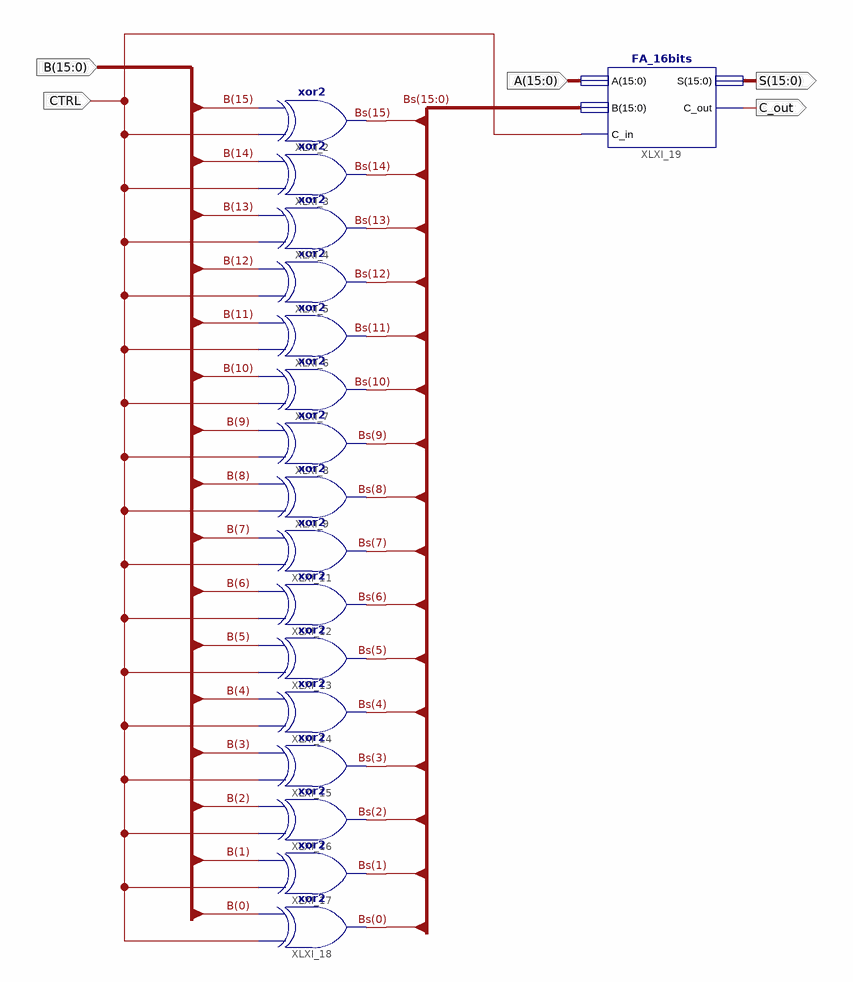
[diagram p0: schematic sheet 1]
// Xilinx ISE schematic FA_2s_16bits.sch (virtex6) as structural Verilog: 17 symbols, 5 ports
module FA_2s_16bits (
  input  [15:0] B,
  input  CTRL,
  input  [15:0] A,
  output [15:0] S,
  output C_out
);

  wire [15:0] Bs;

  xor XLXI_2 (Bs[15], CTRL, B[15]);
  xor XLXI_3 (Bs[14], CTRL, B[14]);
  xor XLXI_4 (Bs[13], CTRL, B[13]);
  xor XLXI_5 (Bs[12], CTRL, B[12]);
  xor XLXI_6 (Bs[11], CTRL, B[11]);
  xor XLXI_7 (Bs[10], CTRL, B[10]);
  xor XLXI_8 (Bs[9], CTRL, B[9]);
  xor XLXI_9 (Bs[8], CTRL, B[8]);
  xor XLXI_11 (Bs[7], CTRL, B[7]);
  xor XLXI_12 (Bs[6], CTRL, B[6]);
  xor XLXI_13 (Bs[5], CTRL, B[5]);
  xor XLXI_14 (Bs[4], CTRL, B[4]);
  xor XLXI_15 (Bs[3], CTRL, B[3]);
  xor XLXI_16 (Bs[2], CTRL, B[2]);
  xor XLXI_17 (Bs[1], CTRL, B[1]);
  xor XLXI_18 (Bs[0], CTRL, B[0]);
  FA_16bits XLXI_19 (.A(A), .B(Bs), .C_in(CTRL), .C_out(C_out), .S(S));
endmodule
